# Altium schematic sheet 02_Block.SchDoc
size A3
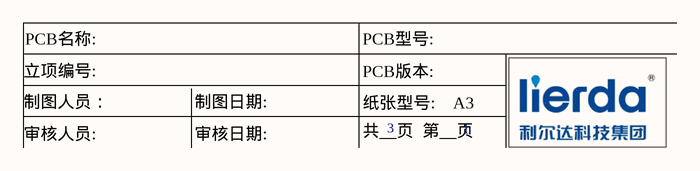
[diagram p0: 02_Block.SchDoc]

## Notes on the sheet
- PCB名称:
- PCB型号:
- 制图人员：
- 立项编号:
- 制图日期:
- 纸张型号:
- PCB版本:
- 3
- A3
- 1
- 审核人员:
- 审核日期:
- 共__页  第__页